# EasyEDA Pro project ProDocument_PCB1_2024-02-29.epro

# Board PCB1
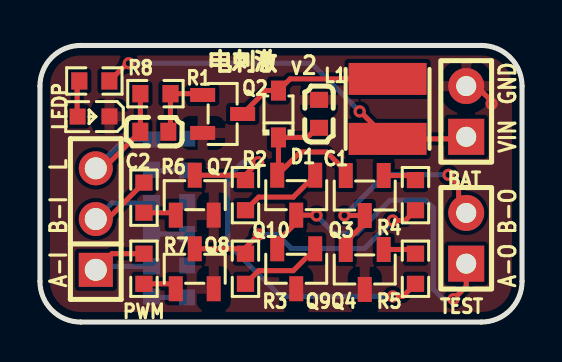
[diagram p0: board, top side]
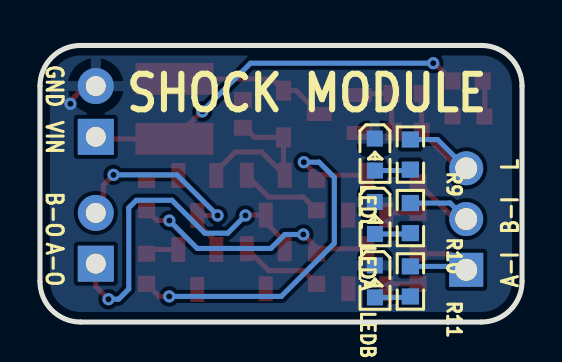
[diagram p1: board, bottom side, seen from below]

Outline 24.13 x 13.84 mm; copper layers: Top Layer, Bottom Layer. Coordinates in mm from the lower left corner of the outline.
Outline path: 0,11.81 0,2.03 arc(0.6,0.6) 2.03,0 22.1,0 arc(23.53,0.6) 24.13,2.03 24.13,11.81 arc(23.53,13.25) 22.1,13.84 2.03,13.84 arc(0.6,13.25) 0,11.81
Stack: Top Layer 0.035mm / Dielectric1 1.51mm FR4 er 4.5 / Bottom Layer 0.035mm

## Design rules (mm)
template: JLCPCB Capability(Two Layers Board)
spacing copperThickness1oz (default): track to track 0.102, other pairs 0.152 to 0.3
spacing copperThickness2oz: track to track 0.203, other pairs 0.152 to 0.3
track width copperThickness1oz (default): min 0.127, default 0.254, max 2.54
track width copperThickness2oz: min 0.203, default 0.254, max 2.54
differential pair differentialPair (default): width min 0.127, default 0.254, max 2.54; gap min 0.152, default 0.152
via viaSize (default): diameter min 0.5, default 0.61, max 10; hole min 0.3, default 0.305, max 6.3

## Placement (name value [footprint] x y rotation side)
BAT  -  [HDR-TH_2P-P2.54-V-M-1]  21.34 10.54 90 top
C1  -  [C0603]  13.97 10.42 90 top
C2  1nF  [C0603]  5.72 9.53 0 top
D1  1N4148WS  [SOD-323_L1.8-W1.3-LS2.5-RD]  11.94 10.41 90 top
L1  330uH  [IND-SMD_L4.0-W4.0_FNR40XXS]  17.4 10.67 270 top
LEDA  XL-1608UPC-06  [LED0603-RD_PINK]  7.37 5.21 270 bottom
LEDB  XL-1608UPC-06  [LED0603-RD_PINK]  7.37 2.03 270 bottom
LEDL  XL-1608UPC-06  [LED0603-RD_PINK]  7.37 8.38 270 bottom
LEDP  XL-1608UPC-06  [LED0603-RD_PINK]  2.68 10.29 180 top
PWM  -  [HDR-TH_3P-P2.54-V-M]  2.79 5.15 90 top
Q2  MMBT5551  [SOT-23-3_L2.9-W1.3-P1.90-LS2.4-BR]  9.14 10.41 180 top
Q3  MMBT5401  [SOT-23-3_L2.9-W1.3-P1.90-LS2.4-BR]  16.26 6.33 90 top
Q4  MMBT5401  [SOT-23-3_L2.9-W1.3-P1.90-LS2.4-BR]  16.26 2.63 90 top
Q7  MMBT5551  [SOT-23-3_L2.9-W1.3-P1.90-LS2.4-BR]  7.75 6.35 270 top
Q8  MMBT5551  [SOT-23-3_L2.9-W1.3-P1.90-LS2.4-BR]  7.75 2.67 270 top
Q9  MMBT5401  [SOT-23-3_L2.9-W1.3-P1.90-LS2.4-BR]  12.83 2.67 90 top
Q10  MMBT5401  [SOT-23-3_L2.9-W1.3-P1.90-LS2.4-BR]  12.83 6.35 90 top
R1  1K  [R0603]  5.78 11.43 0 top
R2  33K  [R0603]  10.29 6.35 270 top
R3  33K  [R0603]  10.29 2.67 270 top
R4  33K  [R0603]  18.8 6.35 270 top
R5  33K  [R0603]  18.8 2.67 270 top
R6  1K  [R0603]  5.21 6.22 270 top
R7  1K  [R0603]  5.21 2.67 270 top
R8  3.3kΩ  [R0603]  2.72 12.06 0 top
R9  3.3kΩ  [R0603]  5.59 8.38 90 bottom
R10  3.3kΩ  [R0603]  5.59 5.2 90 bottom
R11  3.3kΩ  [R0603]  5.59 2.03 90 bottom
TEST  -  [HDR-TH_2P-P2.54-V-M-1]  21.34 4.19 90 top

## Footprints (pads in the part's own frame, mm; a bottom-side part is the same pattern mirrored in y, then rotated)
C0603
  rect 0.8x0.9 smd: 1(-0.7,0) 2(0.7,0)
HDR-TH_2P-P2.54-V-M-1
  rect 1.8x1.8 hole 1: 1(-1.27,0)
  round 1.8 hole 1: 2(1.27,0)
HDR-TH_3P-P2.54-V-M
  rect 1.7x1.7 hole 1.1: 1(-2.54,0)
  round 1.7 hole 1.1: 2(0,0) 3(2.54,0)
IND-SMD_L4.0-W4.0_FNR40XXS
  rect 1.6x3.9 smd: 1(-1.5,0) 2(1.5,0)
LED0603-RD_PINK
  rect 0.8x0.8 smd: 1(-0.799,-0.004) 2(0.799,0.004)
R0603
  rect 0.806x0.864 smd: 1(-0.753,0) 2(0.753,0)
SOD-323_L1.8-W1.3-LS2.5-RD
  rect 1x0.75 smd: 1(-1.173,0) 2(1.173,0)
SOT-23-3_L2.9-W1.3-P1.90-LS2.4-BR
  rect 1.25x0.7 smd: 1(1,-0.95) 2(1,0.95) 3(-1,0)

## Nets
GND: BAT.2 C1.2 LEDA.1 LEDB.1 LEDL.1 LEDP.1 Q2.2 Q4.3 Q7.2 Q8.2 Q9.3
VCC: BAT.1 L1.2 R8.2
IN1: PWM.2 R6.1 R10.2
IN2: PWM.1 R7.1 R11.2
L-BOOST: C2.1 PWM.3 R1.1 R9.2
OUT1: Q9.2 Q10.3 TEST.1
OUT2: Q3.3 Q4.2 TEST.2
$1N633: C2.2 Q2.1 R1.2
$1N635: C1.1 D1.1 Q3.2 Q10.2
$1N636: Q10.1 R2.2
$1N637: Q4.1 R5.1
$1N638: Q9.1 R3.2
$1N639: Q7.3 R2.1 R5.2
$1N640: Q3.1 R4.1
$1N641: Q8.3 R3.1 R4.2
$1N644: Q7.1 R6.2
$1N645: Q8.1 R7.2
$1N1569: D1.2 L1.1 Q2.3
$1N3237: LEDP.2 R8.1
$1N5710: LEDL.2 R9.1
$1N5808: LEDA.2 R10.1
$1N5903: LEDB.2 R11.1

## Via types
v1: diameter 0.61, hole 0.305, Top Layer to Bottom Layer, 11 vias

## Routing (per net, layer and track width the routed paths; a pad name or vN(x,y) marks a point on that pad's centre or on a via; arc(x,y) is an arc through that point)
GND: length 1.7
  Top Layer w0.254: v1(22.61,10.92) 22.61,11.05 21.84,11.81 BAT.2
VCC: length 19.8
  Top Layer w0.254: 3.48,12.06 4.37,12.95 v1(4.44,12.95) ; BAT.1 21.23,9.17 L1.2 16.03,10.54 v1(16,10.54)
  Bottom Layer w0.254: v1(16,10.54) 13.59,12.95 v1(4.44,12.95)
IN1: length 6.3
  Top Layer w0.254: PWM.2 3.38,5.15 R6.1
  Bottom Layer w0.254: 5.59,5.96 3.6,5.96 PWM.2
IN2: length 5.6
  Top Layer w0.254: 2.79,2.61 3.6,3.42 R7.1
  Bottom Layer w0.254: 2.79,2.61 2.97,2.79 R11.2
L-BOOST: length 8.3
  Top Layer w0.254: PWM.3 3.19,7.69 C2.1 5.03,9.53 R1.1
  Bottom Layer w0.254: PWM.3 4.24,9.14 R9.2
OUT1: length 17.5
  Top Layer w0.254: v1(13.84,5.33) 13.83,5.35 Q10.3 12.83,4.98 11.88,4.03 Q9.2 ; TEST.1 21.34,1.78 v1(20.7,1.14)
  Bottom Layer w0.254: v1(20.7,1.14) 20.19,1.14 19.69,1.65 19.69,5.72 19.3,6.1 17.53,6.1 15.88,4.45 14.73,4.45 v1(13.84,5.33)
OUT2: length 11.4
  Top Layer w0.254: TEST.2 20.96,5.84 20.96,6.86 v1(20.45,7.37) ; v1(15.24,5.33) 16.25,5.33 ; Q3.3 16.26,4.95 15.31,4 Q4.2
  Bottom Layer w0.254: v1(15.24,5.33) 17.27,7.37 v1(20.45,7.37)
$1N633: length 3.6
  Top Layer w0.254: C2.2 6.53,9.63 R1.2 8.08,11.43 Q2.1
$1N635: length 8.6
  Top Layer w0.254: 11.94,7.41 13.04,8.51 14.35,8.51 15.31,7.55 Q3.2 ; 11.94,7.41 Q10.2 ; 11.94,7.41 D1.1 13.39,9.24 13.97,9.82
$1N636: length 4.2
  Top Layer w0.254: R2.2 10.94,6.25 12.68,6.25 Q10.1
$1N637: length 1.7
  Top Layer w0.254: R5.1 18.58,3.63 Q4.1
$1N638: length 4.2
  Top Layer w0.254: Q9.1 12.68,2.57 10.94,2.57 R3.2
$1N639: length 19.7
  Top Layer w0.254: Q7.3 10.04,7.35 R2.1 10.29,7.37 v1(10.92,8) ; v1(17.66,1.28) 18.16,1.28 R5.2
  Bottom Layer w0.254: v1(10.92,8) 10.16,8 9.4,7.24 9.4,3.94 12.05,1.28 v1(17.66,1.28)
$1N640: length 1.7
  Top Layer w0.254: R4.1 18.57,7.33 Q3.1
$1N641: length 12.8
  Top Layer w0.254: v1(10.95,4.38) 10.29,3.72 R3.1 10.04,3.67 Q8.3 ; v1(17.65,5.08) 18.28,5.08 R4.2
  Bottom Layer w0.254: v1(10.95,4.38) 11.87,4.38 12.57,3.68 16.26,3.68 v1(17.65,5.08)
$1N644: length 1.6
  Top Layer w0.254: R6.2 6.68,5.47 Q7.1
$1N645: length 1.7
  Top Layer w0.254: Q8.1 6.55,1.91 R7.2
$1N1569: length 8
  Top Layer w0.254: L1.1 12.52,12.17 D1.2 11.32,11.59 Q2.3
$1N3237: length 1.9
  Top Layer w0.254: 1.86,10.19 1.86,11.95 1.98,12.06
$1N5710: length 1.8
  Bottom Layer w0.254: R9.1 5.63,7.58 LEDL.2
$1N5808: length 1.8
  Bottom Layer w0.254: LEDA.2 5.63,4.41 R10.1
$1N5903: length 1.8
  Bottom Layer w0.254: LEDB.2 5.63,1.23 R11.1

## Copper pours and planes (outline as drawn; the poured copper is in the pictures)
GND on Top Layer: -1.65,14.61 24.76,14.61 24.76,-1.65 -1.65,-1.65
GND on Bottom Layer: -2.67,14.86 23.88,14.86 23.88,-1.52 -2.67,-1.52

## Text on the board
Bottom Silkscreen Layer: GND | VIN | L | B-I | A-I | B-O | A-O | SHOCK MODULE
Top Silkscreen Layer: L | B-I | A-I | GND | VIN | B-O | A-O | v2 | 电刺激
